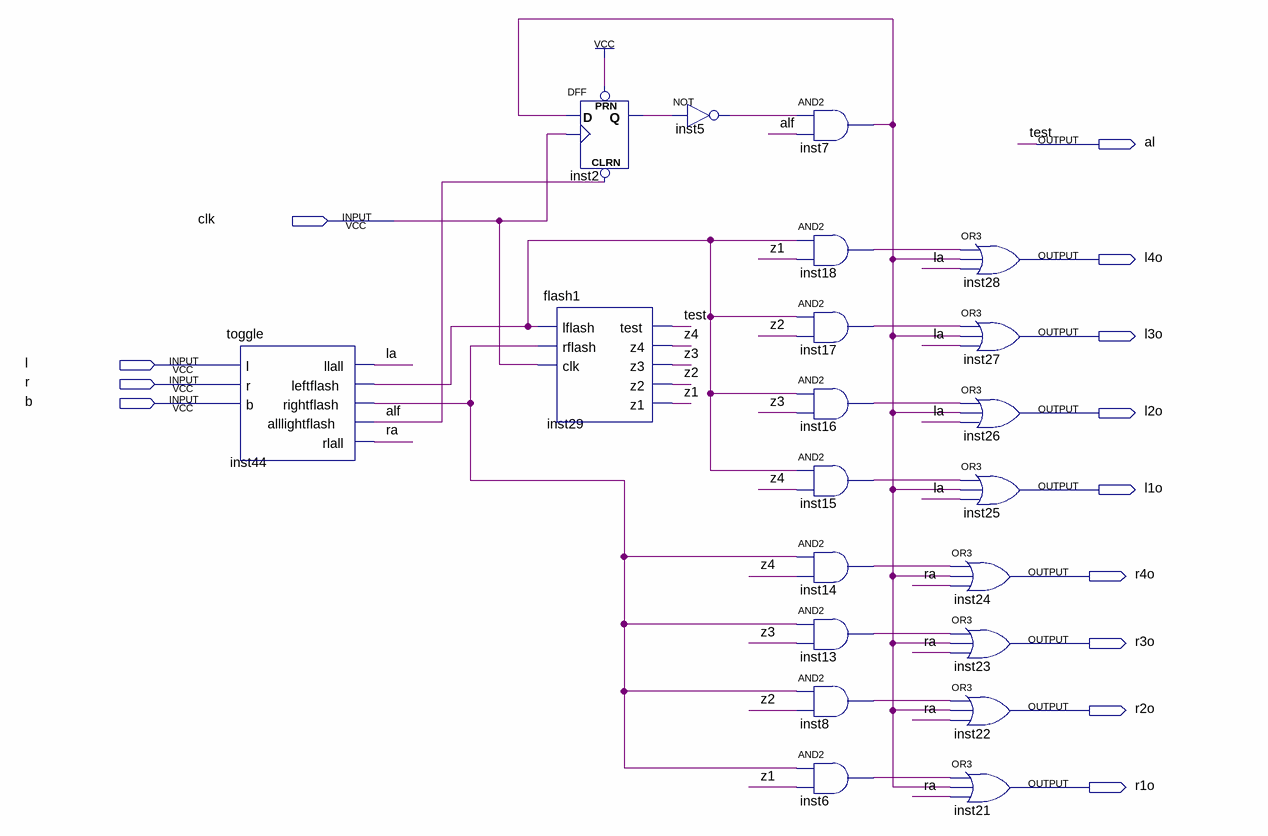
[diagram p0: schematic sheet]
// Quartus schematic light.bdf as structural Verilog: 21 symbols, 13 pins
module light (
  input  clk,
  input  l,
  input  r,
  input  b,
  output al,
  output l4o,
  output l3o,
  output l2o,
  output l1o,
  output r4o,
  output r3o,
  output r2o,
  output r1o
);

  wire alf, inst2_q, inst5_out, inst6_out, inst7_out, inst8_out, inst13_out, inst14_out, inst15_out,
       inst16_out, inst17_out, inst18_out, inst44_leftflash, inst44_rightflash, la, ra, z1, z2, z3, z4;

  toggle inst44 (
    .l(l), .r(r), .b(b), .llall(la), .leftflash(inst44_leftflash), .rightflash(inst44_rightflash),
    .alllightflash(alf), .rlall(ra));
  flash1 inst29 (
    .lflash(inst44_leftflash), .rflash(inst44_rightflash), .clk(clk), .test(al), .z4(z4), .z3(z3), .z2(z2),
    .z1(z1));
  DFF inst2 (.CLRN(alf), .CLK(clk), .D(inst7_out), .PRN(1'b1), .Q(inst2_q));
  not inst5 (inst5_out, inst2_q);
  and inst7 (inst7_out, inst5_out, alf);
  and inst18 (inst18_out, inst44_leftflash, z1);
  and inst17 (inst17_out, inst44_leftflash, z2);
  and inst16 (inst16_out, inst44_leftflash, z3);
  and inst15 (inst15_out, inst44_leftflash, z4);
  and inst14 (inst14_out, inst44_rightflash, z4);
  and inst13 (inst13_out, inst44_rightflash, z3);
  and inst8 (inst8_out, inst44_rightflash, z2);
  and inst6 (inst6_out, inst44_rightflash, z1);
  or inst28 (l4o, inst18_out, inst7_out, la);
  or inst27 (l3o, inst17_out, inst7_out, la);
  or inst26 (l2o, inst16_out, inst7_out, la);
  or inst25 (l1o, inst15_out, inst7_out, la);
  or inst24 (r4o, inst14_out, inst7_out, ra);
  or inst23 (r3o, inst13_out, inst7_out, ra);
  or inst22 (r2o, inst8_out, inst7_out, ra);
  or inst21 (r1o, inst6_out, inst7_out, ra);

  // Other names for the same wires on the sheet: test = al
endmodule
